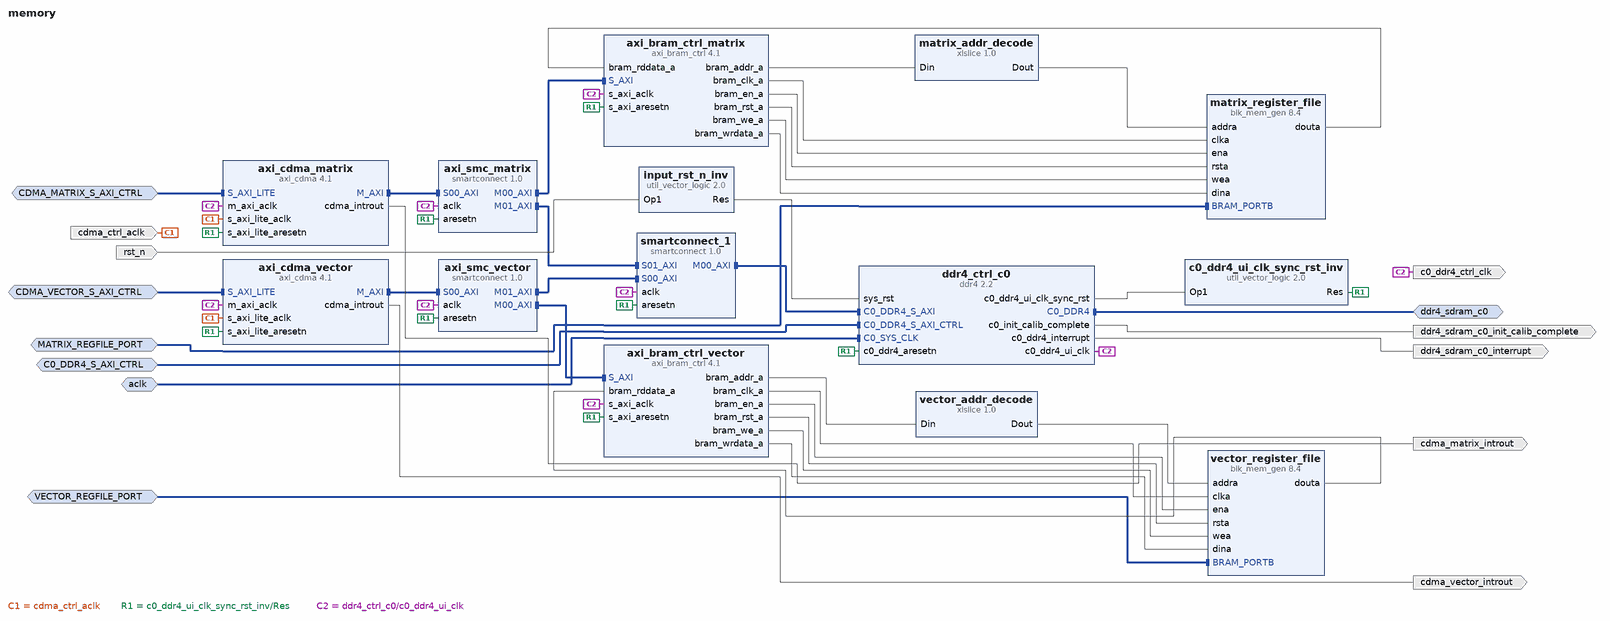
[diagram p0: block diagram of the top level]
# Vivado block design memory, xcu250-figd2104-2L-e, Vivado 2024.1
create_bd_design memory

create_bd_intf_port -mode Master -vlnv xilinx.com:interface:ddr4_rtl:1.0 ddr4_sdram_c0
create_bd_intf_port -mode Slave -vlnv xilinx.com:interface:diff_clock_rtl:1.0 aclk
set_property -dict {CONFIG.FREQ_HZ 300000000} [get_bd_intf_ports aclk]
create_bd_intf_port -mode Slave -vlnv xilinx.com:interface:bram_rtl:1.0 VECTOR_REGFILE_PORT
create_bd_intf_port -mode Slave -vlnv xilinx.com:interface:bram_rtl:1.0 MATRIX_REGFILE_PORT
create_bd_intf_port -mode Slave -vlnv xilinx.com:interface:aximm_rtl:1.0 CDMA_VECTOR_S_AXI_CTRL
set_property -dict [list \
  CONFIG.ADDR_WIDTH 16 \
  CONFIG.ARUSER_WIDTH 0 \
  CONFIG.AWUSER_WIDTH 0 \
  CONFIG.BUSER_WIDTH 0 \
  CONFIG.DATA_WIDTH 32 \
  CONFIG.FREQ_HZ 300000000 \
  CONFIG.HAS_BRESP 1 \
  CONFIG.HAS_BURST 0 \
  CONFIG.HAS_CACHE 0 \
  CONFIG.HAS_LOCK 0 \
  CONFIG.HAS_PROT 0 \
  CONFIG.HAS_QOS 0 \
  CONFIG.HAS_REGION 0 \
  CONFIG.HAS_RRESP 1 \
  CONFIG.HAS_WSTRB 0 \
  CONFIG.ID_WIDTH 0 \
  CONFIG.MAX_BURST_LENGTH 1 \
  CONFIG.NUM_READ_OUTSTANDING 1 \
  CONFIG.NUM_READ_THREADS 1 \
  CONFIG.NUM_WRITE_OUTSTANDING 1 \
  CONFIG.NUM_WRITE_THREADS 1 \
  CONFIG.PROTOCOL AXI4LITE \
  CONFIG.READ_WRITE_MODE READ_WRITE \
  CONFIG.RUSER_BITS_PER_BYTE 0 \
  CONFIG.RUSER_WIDTH 0 \
  CONFIG.SUPPORTS_NARROW_BURST 0 \
  CONFIG.WUSER_BITS_PER_BYTE 0 \
  CONFIG.WUSER_WIDTH 0 \
] [get_bd_intf_ports CDMA_VECTOR_S_AXI_CTRL]
create_bd_intf_port -mode Slave -vlnv xilinx.com:interface:aximm_rtl:1.0 CDMA_MATRIX_S_AXI_CTRL
set_property -dict [list \
  CONFIG.ADDR_WIDTH 16 \
  CONFIG.ARUSER_WIDTH 0 \
  CONFIG.AWUSER_WIDTH 0 \
  CONFIG.BUSER_WIDTH 0 \
  CONFIG.DATA_WIDTH 32 \
  CONFIG.FREQ_HZ 300000000 \
  CONFIG.HAS_BRESP 1 \
  CONFIG.HAS_BURST 0 \
  CONFIG.HAS_CACHE 0 \
  CONFIG.HAS_LOCK 0 \
  CONFIG.HAS_PROT 0 \
  CONFIG.HAS_QOS 0 \
  CONFIG.HAS_REGION 0 \
  CONFIG.HAS_RRESP 1 \
  CONFIG.HAS_WSTRB 0 \
  CONFIG.ID_WIDTH 0 \
  CONFIG.MAX_BURST_LENGTH 1 \
  CONFIG.NUM_READ_OUTSTANDING 1 \
  CONFIG.NUM_READ_THREADS 1 \
  CONFIG.NUM_WRITE_OUTSTANDING 1 \
  CONFIG.NUM_WRITE_THREADS 1 \
  CONFIG.PROTOCOL AXI4LITE \
  CONFIG.READ_WRITE_MODE READ_WRITE \
  CONFIG.RUSER_BITS_PER_BYTE 0 \
  CONFIG.RUSER_WIDTH 0 \
  CONFIG.SUPPORTS_NARROW_BURST 0 \
  CONFIG.WUSER_BITS_PER_BYTE 0 \
  CONFIG.WUSER_WIDTH 0 \
] [get_bd_intf_ports CDMA_MATRIX_S_AXI_CTRL]
create_bd_intf_port -mode Slave -vlnv xilinx.com:interface:aximm_rtl:1.0 C0_DDR4_S_AXI_CTRL
set_property -dict [list \
  CONFIG.ADDR_WIDTH 32 \
  CONFIG.ARUSER_WIDTH 0 \
  CONFIG.AWUSER_WIDTH 0 \
  CONFIG.BUSER_WIDTH 0 \
  CONFIG.DATA_WIDTH 32 \
  CONFIG.HAS_BRESP 1 \
  CONFIG.HAS_BURST 0 \
  CONFIG.HAS_CACHE 0 \
  CONFIG.HAS_LOCK 0 \
  CONFIG.HAS_PROT 0 \
  CONFIG.HAS_QOS 0 \
  CONFIG.HAS_REGION 0 \
  CONFIG.HAS_RRESP 1 \
  CONFIG.HAS_WSTRB 0 \
  CONFIG.ID_WIDTH 0 \
  CONFIG.MAX_BURST_LENGTH 1 \
  CONFIG.NUM_READ_OUTSTANDING 1 \
  CONFIG.NUM_READ_THREADS 1 \
  CONFIG.NUM_WRITE_OUTSTANDING 1 \
  CONFIG.NUM_WRITE_THREADS 1 \
  CONFIG.PROTOCOL AXI4LITE \
  CONFIG.READ_WRITE_MODE READ_WRITE \
  CONFIG.RUSER_BITS_PER_BYTE 0 \
  CONFIG.RUSER_WIDTH 0 \
  CONFIG.SUPPORTS_NARROW_BURST 0 \
  CONFIG.WUSER_BITS_PER_BYTE 0 \
  CONFIG.WUSER_WIDTH 0 \
] [get_bd_intf_ports C0_DDR4_S_AXI_CTRL]
create_bd_port -dir I -type rst rst_n
set_property -dict {CONFIG.POLARITY ACTIVE_LOW} [get_bd_ports rst_n]
create_bd_port -dir O ddr4_sdram_c0_init_calib_complete
create_bd_port -dir O -type intr cdma_matrix_introut
create_bd_port -dir O -type intr cdma_vector_introut
create_bd_port -dir O ddr4_sdram_c0_interrupt
create_bd_port -dir I -type clk cdma_ctrl_aclk
set_property -dict [list \
  CONFIG.ASSOCIATED_BUSIF CDMA_MATRIX_S_AXI_CTRL:CDMA_VECTOR_S_AXI_CTRL \
  CONFIG.FREQ_HZ 300000000 \
] [get_bd_ports cdma_ctrl_aclk]
create_bd_port -dir O -type clk c0_ddr4_ctrl_clk
set_property -dict {CONFIG.ASSOCIATED_BUSIF C0_DDR4_S_AXI_CTRL CONFIG.ASSOCIATED_RESET rst_n} [get_bd_ports c0_ddr4_ctrl_clk]

create_bd_cell -type ip -vlnv xilinx.com:ip:ddr4:2.2 ddr4_ctrl_c0
set_property -dict [list \
  CONFIG.ADDN_UI_CLKOUT1_FREQ_HZ None \
  CONFIG.C0.DDR4_AUTO_AP_COL_A3 true \
  CONFIG.C0.DDR4_MCS_ECC false \
  CONFIG.C0.DDR4_Mem_Add_Map ROW_COLUMN_BANK_INTLV \
  CONFIG.C0.DDR4_SAVE_RESTORE false \
  CONFIG.C0.DDR4_SELF_REFRESH false \
  CONFIG.C0.DDR4_Slot Single \
  CONFIG.C0_CLOCK_BOARD_INTERFACE default_300mhz_clk0 \
  CONFIG.C0_DDR4_BOARD_INTERFACE ddr4_sdram_c0 \
  CONFIG.Debug_Signal Disable \
  CONFIG.RESET_BOARD_INTERFACE resetn \
] [get_bd_cells ddr4_ctrl_c0]
create_bd_cell -type ip -vlnv xilinx.com:ip:axi_cdma:4.1 axi_cdma_matrix
set_property -dict [list \
  CONFIG.C_ADDR_WIDTH 34 \
  CONFIG.C_INCLUDE_SG 0 \
  CONFIG.C_M_AXI_DATA_WIDTH 512 \
  CONFIG.C_M_AXI_MAX_BURST_LEN 64 \
] [get_bd_cells axi_cdma_matrix]
create_bd_cell -type ip -vlnv xilinx.com:ip:util_vector_logic:2.0 input_rst_n_inv
set_property -dict {CONFIG.C_OPERATION not CONFIG.C_SIZE 1} [get_bd_cells input_rst_n_inv]
create_bd_cell -type ip -vlnv xilinx.com:ip:axi_bram_ctrl:4.1 axi_bram_ctrl_matrix
set_property -dict {CONFIG.DATA_WIDTH 1024 CONFIG.SINGLE_PORT_BRAM 1} [get_bd_cells axi_bram_ctrl_matrix]
create_bd_cell -type ip -vlnv xilinx.com:ip:smartconnect:1.0 axi_smc_matrix
set_property -dict {CONFIG.NUM_MI 2 CONFIG.NUM_SI 1} [get_bd_cells axi_smc_matrix]
create_bd_cell -type ip -vlnv xilinx.com:ip:axi_bram_ctrl:4.1 axi_bram_ctrl_vector
set_property -dict {CONFIG.DATA_WIDTH 1024 CONFIG.READ_LATENCY 1 CONFIG.SINGLE_PORT_BRAM 1} [get_bd_cells axi_bram_ctrl_vector]
create_bd_cell -type ip -vlnv xilinx.com:ip:axi_cdma:4.1 axi_cdma_vector
set_property -dict [list \
  CONFIG.C_ADDR_WIDTH 34 \
  CONFIG.C_INCLUDE_SG 0 \
  CONFIG.C_M_AXI_DATA_WIDTH 512 \
  CONFIG.C_M_AXI_MAX_BURST_LEN 64 \
] [get_bd_cells axi_cdma_vector]
create_bd_cell -type ip -vlnv xilinx.com:ip:smartconnect:1.0 axi_smc_vector
set_property -dict {CONFIG.NUM_MI 2 CONFIG.NUM_SI 1} [get_bd_cells axi_smc_vector]
create_bd_cell -type ip -vlnv xilinx.com:ip:util_vector_logic:2.0 c0_ddr4_ui_clk_sync_rst_inv
set_property -dict {CONFIG.C_OPERATION not CONFIG.C_SIZE 1} [get_bd_cells c0_ddr4_ui_clk_sync_rst_inv]
create_bd_cell -type ip -vlnv xilinx.com:ip:smartconnect:1.0 smartconnect_1
create_bd_cell -type ip -vlnv xilinx.com:ip:blk_mem_gen:8.4 vector_register_file
set_property -dict [list \
  CONFIG.Byte_Size 8 \
  CONFIG.EN_SAFETY_CKT false \
  CONFIG.Enable_32bit_Address false \
  CONFIG.Memory_Type True_Dual_Port_RAM \
  CONFIG.Register_PortA_Output_of_Memory_Core false \
  CONFIG.Use_Byte_Write_Enable true \
  CONFIG.Use_RSTA_Pin true \
  CONFIG.Write_Depth_A 16 \
  CONFIG.Write_Width_A 1024 \
  CONFIG.Write_Width_B 1024 \
  CONFIG.use_bram_block Stand_Alone \
] [get_bd_cells vector_register_file]
create_bd_cell -type ip -vlnv xilinx.com:ip:blk_mem_gen:8.4 matrix_register_file
set_property -dict [list \
  CONFIG.Byte_Size 8 \
  CONFIG.EN_SAFETY_CKT false \
  CONFIG.Enable_32bit_Address false \
  CONFIG.Memory_Type True_Dual_Port_RAM \
  CONFIG.Register_PortA_Output_of_Memory_Core false \
  CONFIG.Use_Byte_Write_Enable true \
  CONFIG.Use_RSTA_Pin true \
  CONFIG.Write_Depth_A 16 \
  CONFIG.Write_Width_A 1024 \
  CONFIG.Write_Width_B 4096 \
  CONFIG.use_bram_block Stand_Alone \
] [get_bd_cells matrix_register_file]
create_bd_cell -type ip -vlnv xilinx.com:ip:xlslice:1.0 matrix_addr_decode
set_property -dict {CONFIG.DIN_FROM 10 CONFIG.DIN_TO 7 CONFIG.DIN_WIDTH 16} [get_bd_cells matrix_addr_decode]
create_bd_cell -type ip -vlnv xilinx.com:ip:xlslice:1.0 vector_addr_decode
set_property -dict {CONFIG.DIN_FROM 10 CONFIG.DIN_TO 7 CONFIG.DIN_WIDTH 16} [get_bd_cells vector_addr_decode]

# ---- connections ----

connect_bd_intf_net -intf_net BRAM_PORTB_0_1 [get_bd_intf_ports VECTOR_REGFILE_PORT] [get_bd_intf_pins vector_register_file/BRAM_PORTB]
connect_bd_intf_net -intf_net BRAM_PORTB_1_1 [get_bd_intf_ports MATRIX_REGFILE_PORT] [get_bd_intf_pins matrix_register_file/BRAM_PORTB]
connect_bd_intf_net -intf_net C0_DDR4_S_AXI_CTRL_0_1 [get_bd_intf_ports C0_DDR4_S_AXI_CTRL] [get_bd_intf_pins ddr4_ctrl_c0/C0_DDR4_S_AXI_CTRL]
connect_bd_intf_net -intf_net S_AXI_LITE_0_1 [get_bd_intf_ports CDMA_VECTOR_S_AXI_CTRL] [get_bd_intf_pins axi_cdma_vector/S_AXI_LITE]
connect_bd_intf_net -intf_net S_AXI_LITE_1_1 [get_bd_intf_ports CDMA_MATRIX_S_AXI_CTRL] [get_bd_intf_pins axi_cdma_matrix/S_AXI_LITE]
connect_bd_intf_net -intf_net axi_cdma_0_M_AXI [get_bd_intf_pins axi_cdma_matrix/M_AXI] [get_bd_intf_pins axi_smc_matrix/S00_AXI]
connect_bd_intf_net -intf_net axi_cdma_1_M_AXI [get_bd_intf_pins axi_cdma_vector/M_AXI] [get_bd_intf_pins axi_smc_vector/S00_AXI]
connect_bd_intf_net -intf_net axi_smc_1_M00_AXI [get_bd_intf_pins axi_smc_vector/M00_AXI] [get_bd_intf_pins axi_bram_ctrl_vector/S_AXI]
connect_bd_intf_net -intf_net axi_smc_M00_AXI [get_bd_intf_pins axi_smc_matrix/M00_AXI] [get_bd_intf_pins axi_bram_ctrl_matrix/S_AXI]
connect_bd_intf_net [get_bd_intf_pins axi_smc_matrix/M01_AXI] [get_bd_intf_pins smartconnect_1/S01_AXI]
connect_bd_intf_net [get_bd_intf_pins axi_smc_vector/M01_AXI] [get_bd_intf_pins smartconnect_1/S00_AXI]
connect_bd_intf_net -intf_net ddr4_0_C0_DDR4 [get_bd_intf_ports ddr4_sdram_c0] [get_bd_intf_pins ddr4_ctrl_c0/C0_DDR4]
connect_bd_intf_net -intf_net default_300mhz_clk0_1 [get_bd_intf_ports aclk] [get_bd_intf_pins ddr4_ctrl_c0/C0_SYS_CLK]
connect_bd_intf_net [get_bd_intf_pins smartconnect_1/M00_AXI] [get_bd_intf_pins ddr4_ctrl_c0/C0_DDR4_S_AXI]
connect_bd_net -net aclk1_0_1 [get_bd_ports cdma_ctrl_aclk] \
  [get_bd_pins axi_cdma_matrix/s_axi_lite_aclk] [get_bd_pins axi_cdma_vector/s_axi_lite_aclk]
connect_bd_net [get_bd_pins axi_bram_ctrl_matrix/bram_addr_a] [get_bd_pins matrix_addr_decode/Din]
connect_bd_net [get_bd_pins axi_bram_ctrl_matrix/bram_clk_a] [get_bd_pins matrix_register_file/clka]
connect_bd_net [get_bd_pins axi_bram_ctrl_matrix/bram_en_a] [get_bd_pins matrix_register_file/ena]
connect_bd_net [get_bd_pins axi_bram_ctrl_matrix/bram_rst_a] [get_bd_pins matrix_register_file/rsta]
connect_bd_net [get_bd_pins axi_bram_ctrl_matrix/bram_we_a] [get_bd_pins matrix_register_file/wea]
connect_bd_net [get_bd_pins axi_bram_ctrl_matrix/bram_wrdata_a] [get_bd_pins matrix_register_file/dina]
connect_bd_net [get_bd_pins axi_bram_ctrl_vector/bram_addr_a] [get_bd_pins vector_addr_decode/Din]
connect_bd_net [get_bd_pins axi_bram_ctrl_vector/bram_clk_a] [get_bd_pins vector_register_file/clka]
connect_bd_net [get_bd_pins axi_bram_ctrl_vector/bram_en_a] [get_bd_pins vector_register_file/ena]
connect_bd_net [get_bd_pins axi_bram_ctrl_vector/bram_rst_a] [get_bd_pins vector_register_file/rsta]
connect_bd_net [get_bd_pins axi_bram_ctrl_vector/bram_we_a] [get_bd_pins vector_register_file/wea]
connect_bd_net [get_bd_pins axi_bram_ctrl_vector/bram_wrdata_a] [get_bd_pins vector_register_file/dina]
connect_bd_net -net axi_cdma_0_cdma_introut [get_bd_pins axi_cdma_matrix/cdma_introut] [get_bd_ports cdma_matrix_introut]
connect_bd_net -net axi_cdma_1_cdma_introut [get_bd_pins axi_cdma_vector/cdma_introut] [get_bd_ports cdma_vector_introut]
connect_bd_net -net ddr4_0_c0_ddr4_interrupt [get_bd_pins ddr4_ctrl_c0/c0_ddr4_interrupt] [get_bd_ports ddr4_sdram_c0_interrupt]
connect_bd_net -net ddr4_0_c0_ddr4_ui_clk_sync_rst [get_bd_pins c0_ddr4_ui_clk_sync_rst_inv/Res] \
  [get_bd_pins axi_cdma_vector/s_axi_lite_aresetn] [get_bd_pins axi_cdma_matrix/s_axi_lite_aresetn] \
  [get_bd_pins axi_smc_matrix/aresetn] [get_bd_pins axi_smc_vector/aresetn] [get_bd_pins axi_bram_ctrl_vector/s_axi_aresetn] \
  [get_bd_pins axi_bram_ctrl_matrix/s_axi_aresetn] [get_bd_pins ddr4_ctrl_c0/c0_ddr4_aresetn] \
  [get_bd_pins smartconnect_1/aresetn]
connect_bd_net -net ddr4_0_c0_ddr4_ui_clk_sync_rst1 [get_bd_pins ddr4_ctrl_c0/c0_ddr4_ui_clk_sync_rst] [get_bd_pins c0_ddr4_ui_clk_sync_rst_inv/Op1]
connect_bd_net -net ddr4_0_c0_init_calib_complete [get_bd_pins ddr4_ctrl_c0/c0_init_calib_complete] [get_bd_ports ddr4_sdram_c0_init_calib_complete]
connect_bd_net [get_bd_pins ddr4_ctrl_c0/c0_ddr4_ui_clk] \
  [get_bd_ports c0_ddr4_ctrl_clk] [get_bd_pins axi_cdma_matrix/m_axi_aclk] [get_bd_pins axi_bram_ctrl_matrix/s_axi_aclk] \
  [get_bd_pins axi_smc_matrix/aclk] [get_bd_pins axi_cdma_vector/m_axi_aclk] [get_bd_pins axi_smc_vector/aclk] \
  [get_bd_pins axi_bram_ctrl_vector/s_axi_aclk] [get_bd_pins smartconnect_1/aclk]
connect_bd_net -net matrix_addr_decode1_Dout [get_bd_pins vector_addr_decode/Dout] [get_bd_pins vector_register_file/addra]
connect_bd_net [get_bd_pins matrix_register_file/douta] [get_bd_pins axi_bram_ctrl_matrix/bram_rddata_a]
connect_bd_net -net resetn_1 [get_bd_ports rst_n] [get_bd_pins input_rst_n_inv/Op1]
connect_bd_net -net resetn_inv_0_Res [get_bd_pins input_rst_n_inv/Res] [get_bd_pins ddr4_ctrl_c0/sys_rst]
connect_bd_net [get_bd_pins vector_register_file/douta] [get_bd_pins axi_bram_ctrl_vector/bram_rddata_a]
connect_bd_net -net xlslice_0_Dout [get_bd_pins matrix_addr_decode/Dout] [get_bd_pins matrix_register_file/addra]

# ---- address map ----
assign_bd_address -offset 0x0C0000000 -range 32K -target_address_space [get_bd_addr_spaces axi_cdma_matrix/Data] [get_bd_addr_segs axi_bram_ctrl_matrix/S_AXI/Mem0]
assign_bd_address -offset 0x200000000 -range 8G -target_address_space [get_bd_addr_spaces axi_cdma_matrix/Data] [get_bd_addr_segs ddr4_ctrl_c0/C0_DDR4_MEMORY_MAP/C0_DDR4_ADDRESS_BLOCK]
assign_bd_address -offset 0x0C0000000 -range 4K -target_address_space [get_bd_addr_spaces axi_cdma_vector/Data] [get_bd_addr_segs axi_bram_ctrl_vector/S_AXI/Mem0]
assign_bd_address -offset 0x200000000 -range 8G -target_address_space [get_bd_addr_spaces axi_cdma_vector/Data] [get_bd_addr_segs ddr4_ctrl_c0/C0_DDR4_MEMORY_MAP/C0_DDR4_ADDRESS_BLOCK]
assign_bd_address -offset 0x80000000 -range 1M -target_address_space [get_bd_addr_spaces C0_DDR4_S_AXI_CTRL] [get_bd_addr_segs ddr4_ctrl_c0/C0_DDR4_MEMORY_MAP_CTRL/C0_REG]
assign_bd_address -offset 0x0000 -range 256 -target_address_space [get_bd_addr_spaces CDMA_MATRIX_S_AXI_CTRL] [get_bd_addr_segs axi_cdma_matrix/S_AXI_LITE/Reg]
assign_bd_address -offset 0x0000 -range 256 -target_address_space [get_bd_addr_spaces CDMA_VECTOR_S_AXI_CTRL] [get_bd_addr_segs axi_cdma_vector/S_AXI_LITE/Reg]

validate_bd_design
save_bd_design
